# EAGLE design multi-level_converter (EAGLE 6.6.0)
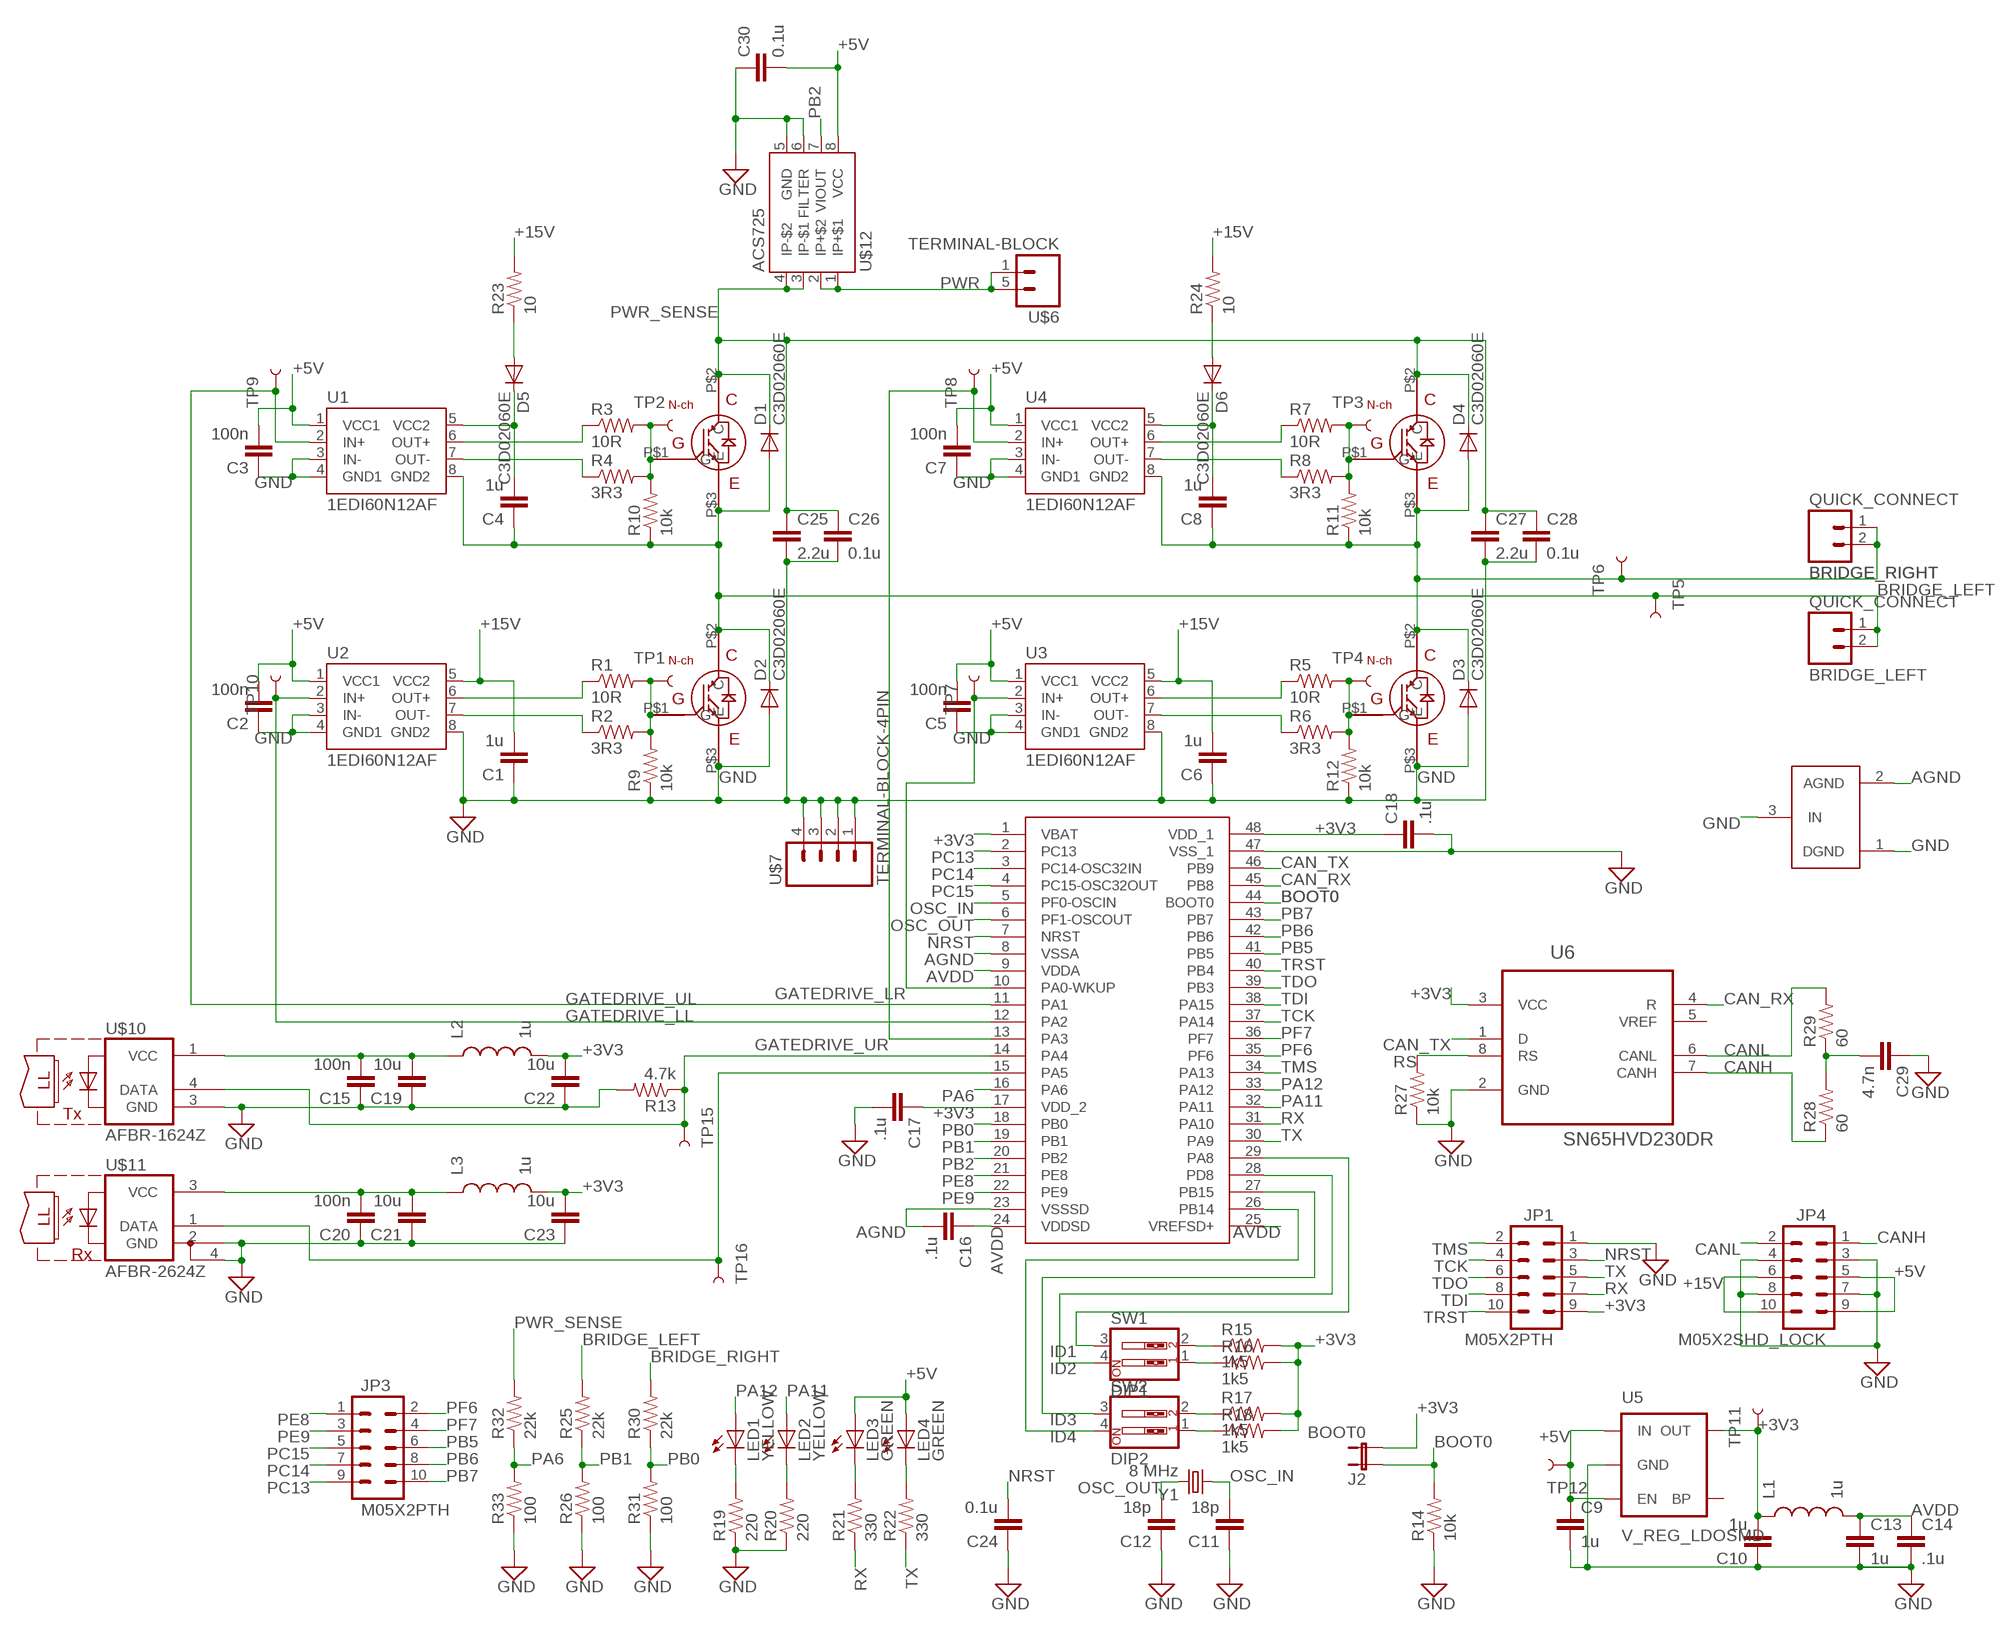
[diagram p0: schematic, sheet 1]

## Parts
BRIDGE_LEFT  QUICK_CONNECT  [QUICK_CONNECT]
BRIDGE_RIGHT  QUICK_CONNECT  [QUICK_CONNECT]
C1  1u  CAP0805  [0805]
C2  100n  CAP0805  [0805]
C3  100n  CAP0805  [0805]
C4  1u  CAP0805  [0805]
C5  100n  CAP0805  [0805]
C6  1u  CAP0805  [0805]
C7  100n  CAP0805  [0805]
C8  1u  CAP0805  [0805]
C9  1u  CAP0805  [0805]
C10  1u  CAP0805  [0805]
C11  18p  CAP0805  [0805]
C12  18p  CAP0805  [0805]
C13  1u  CAP0805  [0805]
C14  .1u  CAP0805  [0805]
C15  100n  CAP0805  [0805]
C16  .1u  CAP0805  [0805]
C17  .1u  CAP0805  [0805]
C18  .1u  CAP0805  [0805]
C19  10u  CAP0805  [0805]
C20  100n  CAP0805  [0805]
C21  10u  CAP0805  [0805]
C22  10u  CAP0805  [0805]
C23  10u  CAP0805  [0805]
C24  0.1u  CAP0805  [0805]
C25  2.2u  C37/20  [C37.5B20]
C26  0.1u  C-EUC2225K  [C2225K]
C27  2.2u  C37/20  [C37.5B20]
C28  0.1u  C-EUC2225K  [C2225K]
C29  4.7n  CAP0805  [0805]
C30  0.1u  CAP0805  [0805]
D1  C3D02060E  [TO252]
D2  C3D02060E  [TO252]
D3  C3D02060E  [TO252]
D4  C3D02060E  [TO252]
D5  C3D02060E  [TO252]
D6  C3D02060E  [TO252]
J1  GND_CONNECT  [GND_CONNECT]
J2  BOOT0  JUMPER-2PTH  [1X02]
JP1  M05X2PTH  [AVR_ICSP]
JP3  M05X2PTH  [AVR_ICSP]
JP4  M05X2SHD_LOCK  [2X5-SHROUDED_LOCK]
L1  1u  INDUCTOR0805  [0805]
L2  1u  INDUCTOR0805  [0805]
L3  1u  INDUCTOR0805  [0805]
LED1  YELLOW  LED0603  [LED-0603]
LED2  YELLOW  LED0603  [LED-0603]
LED3  GREEN  LED0603  [LED-0603]
LED4  GREEN  LED0603  [LED-0603]
R1  10R  RESISTOR0805-RES  [0805]
R2  3R3  RESISTOR0805-RES  [0805]
R3  10R  RESISTOR0805-RES  [0805]
R4  3R3  RESISTOR0805-RES  [0805]
R5  10R  RESISTOR0805-RES  [0805]
R6  3R3  RESISTOR0805-RES  [0805]
R7  10R  RESISTOR0805-RES  [0805]
R8  3R3  RESISTOR0805-RES  [0805]
R9  10k  RESISTOR0805-RES  [0805]
R10  10k  RESISTOR0805-RES  [0805]
R11  10k  RESISTOR0805-RES  [0805]
R12  10k  RESISTOR0805-RES  [0805]
R13  4.7k  RESISTOR0805-RES  [0805]
R14  10k  RESISTOR0805-RES  [0805]
R15  1k5  RESISTOR0805-RES  [0805]
R16  1k5  RESISTOR0805-RES  [0805]
R17  1k5  RESISTOR0805-RES  [0805]
R18  1k5  RESISTOR0805-RES  [0805]
R19  220  RESISTOR0805-RES  [0805]
R20  220  RESISTOR0805-RES  [0805]
R21  330  RESISTOR0805-RES  [0805]
R22  330  RESISTOR0805-RES  [0805]
R23  10  RESISTOR0805-RES  [0805]
R24  10  RESISTOR0805-RES  [0805]
R25  22k  RESISTOR0805-RES  [0805]
R26  100  RESISTOR0805-RES  [0805]
R27  10k  RESISTOR0805-RES  [0805]
R28  60  RESISTOR0805-RES  [0805]
R29  60  RESISTOR0805-RES  [0805]
R30  22k  RESISTOR0805-RES  [0805]
R31  100  RESISTOR0805-RES  [0805]
R32  22k  RESISTOR0805-RES  [0805]
R33  100  RESISTOR0805-RES  [0805]
SW1  DIP1  SW_DIP-2  [DIPSWITCH-02]
SW2  DIP2  SW_DIP-2  [DIPSWITCH-02]
TP1  TEST-POINT3X5  [PAD.03X.05]
TP2  TEST-POINT3X5  [PAD.03X.05]
TP3  TEST-POINT3X5  [PAD.03X.05]
TP4  TEST-POINT3X5  [PAD.03X.05]
TP5  TEST-POINT3X5  [PAD.03X.05]
TP6  TEST-POINT3X5  [PAD.03X.05]
TP7  TEST-POINT3X5  [PAD.03X.05]
TP8  TEST-POINT3X5  [PAD.03X.05]
TP9  TEST-POINT3X5  [PAD.03X.05]
TP10  TEST-POINT3X5  [PAD.03X.05]
TP11  TEST-POINT3X5  [PAD.03X.05]
TP12  TEST-POINT3X5  [PAD.03X.05]
TP15  TEST-POINT3X5  [PAD.03X.05]
TP16  TEST-POINT3X5  [PAD.03X.05]
U1  1EDI60N12AF  [SO08]
U2  1EDI60N12AF  [SO08]
U3  1EDI60N12AF  [SO08]
U4  1EDI60N12AF  [SO08]
U5  V_REG_LDOSMD  [SOT23-5]
U6  SN65HVD230DR  [SOIC127P600X175-8N]
U$1  TO-247B  [TO-247-FLAT]
U$2  TO-247B  [TO-247-FLAT]
U$3  TO-247B  [TO-247-FLAT]
U$4  TO-247B  [TO-247-FLAT]
U$5  STM32F373CCT6  [LQFP48]
U$6  TERMINAL-BLOCK  [10MM_2PIN_CONNECTOR]
U$7  TERMINAL-BLOCK-4PIN  [10MM_4PIN_CONNECTOR]
U$10  AFBR-1624Z  [HFBR-15X3]
U$11  AFBR-2624Z  [HFBR-15X3]
U$12  ACS725  [SO08]
Y1  8 MHz  CRYSTALSMD  [HC49UP]

## Nets
+3V3: C10.2 C17.1 C18.1 C22.2 C23.2 J2.2 JP1.9 L1.1 L2.2 L3.2 R15.2 R16.2 R17.2 R18.2 TP11.P$1 U5.VS(OUT) U6.3(VCC) U$5.1(VBAT) U$5.17(VDD_2) U$5.48(VDD_1)
+5V: C2.2 C3.2 C5.2 C7.2 C9.1 C30.2 JP4.5 JP4.9 LED3.A LED4.A TP12.P$1 U1.1(VCC1) U2.1(VCC1) U3.1(VCC1) U4.1(VCC1) U5.CS(IN) U5.GATE(EN) U$12.8(VCC)
+15V: C1.2 C6.2 JP4.6 JP4.10 R23.2 R24.2 U2.5(VCC2) U3.5(VCC2)
AGND: C16.2 J1.2(AGND) U$5.8(VSSA) U$5.23(VSSSD)
AVDD: C13.1 C14.1 C16.1 L1.2 U$5.9(VDDA) U$5.24(VDDSD) U$5.25(VREFSD+)
BOOT0: J2.1 R14.2 U$5.44(BOOT0)
BRIDGE_LEFT: BRIDGE_LEFT.1 BRIDGE_LEFT.2 C4.1 D1.2(A) D2.1(C) D2.3(C) R10.1 R25.2 TP5.P$1 U1.8(GND2) U$1.P$3(E) U$3.P$2(C)
BRIDGE_RIGHT: BRIDGE_RIGHT.1 BRIDGE_RIGHT.2 C8.1 D3.1(C) D3.3(C) D4.2(A) R11.1 R30.2 TP6.P$1 U4.8(GND2) U$2.P$2(C) U$4.P$3(E)
CAN_RX: U6.4(R) U$5.45(PB8)
CAN_TX: U6.1(D) U$5.46(PB9)
CANH: JP4.1 R28.1 U6.7(CANH)
CANL: JP4.2 R29.2 U6.6(CANL)
G_LL: R1.2 R2.2 R9.2 TP1.P$1 U$3.P$1(G)
G_LR: R5.2 R6.2 R12.2 TP4.P$1 U$2.P$1(G)
G_UL: R3.2 R4.2 R10.2 TP2.P$1 U$1.P$1(G)
G_UR: R7.2 R8.2 R11.2 TP3.P$1 U$4.P$1(G)
GATEDRIVE_LL: TP10.P$1 U2.2(IN+) U$5.12(PA2)
GATEDRIVE_LR: TP7.P$1 U3.2(IN+) U$5.10(PA0-WKUP)
GATEDRIVE_UL: TP9.P$1 U1.2(IN+) U$5.11(PA1)
GATEDRIVE_UR: TP8.P$1 U4.2(IN+) U$5.13(PA3)
GND: C1.1 C2.1 C3.1 C5.1 C6.1 C7.1 C9.2 C10.1 C11.1 C12.1 C13.2 C14.2 C15.1 C17.2 C18.2 C19.1 C20.1 C21.1 C22.1 C23.1 C24.1 C25.2 C26.2 C27.2 C28.2 C29.1 C30.1 D2.2(A) D3.2(A) J1.1(DGND) J1.3(IN) JP1.1 JP4.3 JP4.4 JP4.7 JP4.8 R9.1 R12.1 R13.2 R14.1 R19.1 R20.1 R26.1 R27.1 R31.1 R33.1 U1.3(IN-) U1.4(GND1) U2.3(IN-) U2.4(GND1) U2.8(GND2) U3.3(IN-) U3.4(GND1) U3.8(GND2) U4.3(IN-) U4.4(GND1) U5.N/C(GND) U6.2(GND) U$2.P$3(E) U$3.P$3(E) U$5.47(VSS_1) U$7.1 U$7.2 U$7.3 U$7.4 U$10.3(GND) U$11.2(GND) U$11.4(GND1) U$12.5(GND) U$12.6(FILTER)
ID1: SW1.3 U$5.29(PA8)
ID2: SW1.4 U$5.28(PD8)
ID3: SW2.3 U$5.27(PB15)
ID4: SW2.4 U$5.26(PB14)
N$1: C8.2 D6.1(C) D6.3(C) U4.5(VCC2)
N$4: R1.1 U2.6(OUT+)
N$5: R2.1 U2.7(OUT-)
N$6: R3.1 U1.6(OUT+)
N$7: R4.1 U1.7(OUT-)
N$9: R5.1 U3.6(OUT+)
N$10: R6.1 U3.7(OUT-)
N$12: R7.1 U4.6(OUT+)
N$13: R8.1 U4.7(OUT-)
N$21: LED3.C R21.2
N$22: LED4.C R22.2
N$23: R15.1 SW1.2
N$24: R16.1 SW1.1
N$25: R17.1 SW2.2
N$27: R18.1 SW2.1
N$29: C15.2 C19.2 L2.1 U$10.1(VCC)
N$30: C20.2 C21.2 L3.1 U$11.3(VCC)
N$32: R13.1 TP15.P$1 U$5.14(PA4) U$10.4(DATA)
N$33: TP16.P$1 U$5.15(PA5) U$11.1(DATA)
N$34: LED1.C R19.2
N$35: LED2.C R20.2
N$36: D5.2(A) R23.1
N$37: C4.2 D5.1(C) D5.3(C) U1.5(VCC2)
N$38: D6.2(A) R24.1
N$42: C29.2 R28.2 R29.1
NRST: C24.2 JP1.3 U$5.7(NRST)
OSC_IN: C11.2 U$5.5(PF0-OSCIN) Y1.1
OSC_OUT: C12.2 U$5.6(PF1-OSCOUT) Y1.2
PA6: R32.1 R33.2 U$5.16(PA6)
PA11: LED2.A U$5.32(PA11)
PA12: LED1.A U$5.33(PA12)
PB0: R30.1 R31.2 U$5.18(PB0)
PB1: R25.1 R26.2 U$5.19(PB1)
PB2: U$5.20(PB2) U$12.7(VIOUT)
PB5: JP3.6 U$5.41(PB5)
PB6: JP3.8 U$5.42(PB6)
PB7: JP3.10 U$5.43(PB7)
PC13: JP3.9 U$5.2(PC13)
PC14: JP3.7 U$5.3(PC14-OSC32IN)
PC15: JP3.5 U$5.4(PC15-OSC32OUT)
PE8: JP3.1 U$5.21(PE8)
PE9: JP3.3 U$5.22(PE9)
PF6: JP3.2 U$5.35(PF6)
PF7: JP3.4 U$5.36(PF7)
PWR: U$6.1 U$6.5 U$12.1(IP+$1) U$12.2(IP+$2)
PWR_SENSE: C25.1 C26.1 C27.1 C28.1 D1.1(C) D1.3(C) D4.1(C) D4.3(C) R32.2 U$1.P$2(C) U$4.P$2(C) U$12.3(IP-$1) U$12.4(IP-$2)
RS: R27.2 U6.8(RS)
RX: JP1.7 R21.1 U$5.31(PA10)
TCK: JP1.4 U$5.37(PA14)
TDI: JP1.8 U$5.38(PA15)
TDO: JP1.6 U$5.39(PB3)
TMS: JP1.2 U$5.34(PA13)
TRST: JP1.10 U$5.40(PB4)
TX: JP1.5 R22.1 U$5.30(PA9)
Unconnected: U5.COM(BP) U6.5(VREF)

## Library data of the parts
BRIDGE_LEFT BRIDGE_RIGHT = DragonflyLBR2:QUICK_CONNECT
C1-C24 C29 C30 = DragonflyLBR2:CAP: Capacitor Standard 0603 ceramic capacitor, and 0.1" leaded capacitor.
C25 C27 = capacitor-wima:C: CAPACITOR naming: grid - package width
C26 C28 = resistor:C-EU: CAPACITOR, European symbol
D1-D6 = DragonflyLBR2:C3D02060E
J1 = DragonflyLBR2:GND_CONNECT
J2 = DragonflyLBR2:JUMPER-2: Jumper Basic 0.1" spaced jumper. Use with breakaway headers.
JP1 JP3 JP4 = DragonflyLBR2:M05X2: Header 5x2 Standard 10-pin dual row 0.1" header. Commonly used with AVR-ISP. Use with Spark Fun Electronics SKU: PRT-00778
L1-L3 = DragonflyLBR2:INDUCTOR: Inductors Basic Inductor/Choke - 0603 and 1206. Footprints are not proven and vary greatly between part numbers.
LED1-LED4 = DragonflyLBR2:LED: LEDs Standard schematic elements and footprints for 5mm, 3mm, 1206, and 0603 sized LEDs. 5mm - Spark Fun Electronics SKU : COM-00529 (and others)
R1-R33 = DragonflyLBR2:RESISTOR: Resistor Basic schematic elements and footprints for 0603, 1206, and PTH resistors.
SW1 SW2 = DragonflyLBR2:SW_DIP-2: DIP SWITCH
TP1-TP12 TP15 TP16 = DragonflyLBR2:TEST-POINT
U1-U4 = DragonflyLBR2:1EDI60N12AF
U5 = DragonflyLBR2:V_REG_LDO: Voltage Regulator LDO Standard 150mA LDO voltage regulator in SOT-23 layout. Micrel part MIC5205. BP (by-pass) pin is used to lower output noise with 470pF cap.
U6 = Texas Instruments_By_element14_Batch_1:SN65HVD230DR: 3.3-V CAN TRANSCEIVERS; MPN: SN65HVD230DR; OC_FARNELL: 8452148; OC_NEWARK: 75C7745; PACKAGE: SOIC-8; SUPPLIER: Texas Instruments
U$1-U$4 = DragonflyLBR2:TO-247
U$5 = carrilib:STM32F373CCT6
U$6 = DragonflyLBR2:TERMINAL-BLOCK
U$7 = DragonflyLBR2:TERMINAL-BLOCK-4PIN
U$10 = fiber-optic-hp:AFBR-1624Z
U$11 = fiber-optic-hp:AFBR-2624Z
U$12 = DragonflyLBR2:ACS725
Y1 = DragonflyLBR2:CRYSTAL: Crystals Various standard crystals. Proven footprints. Spark Fun Electronics SKU : COM-00534

## Board
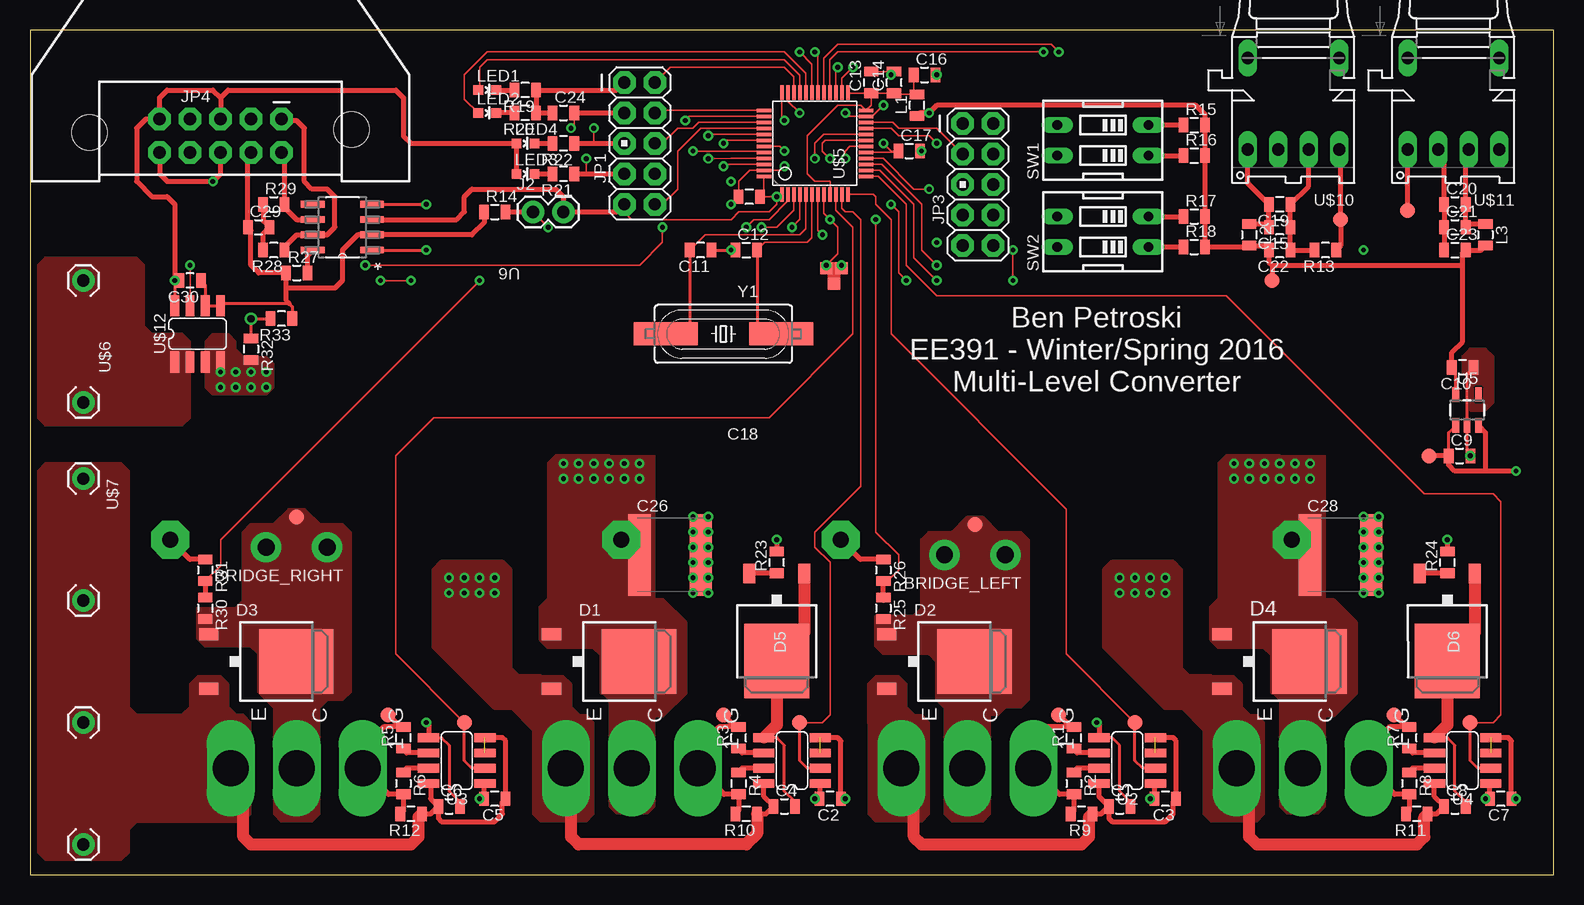
[diagram p1: board, top side]
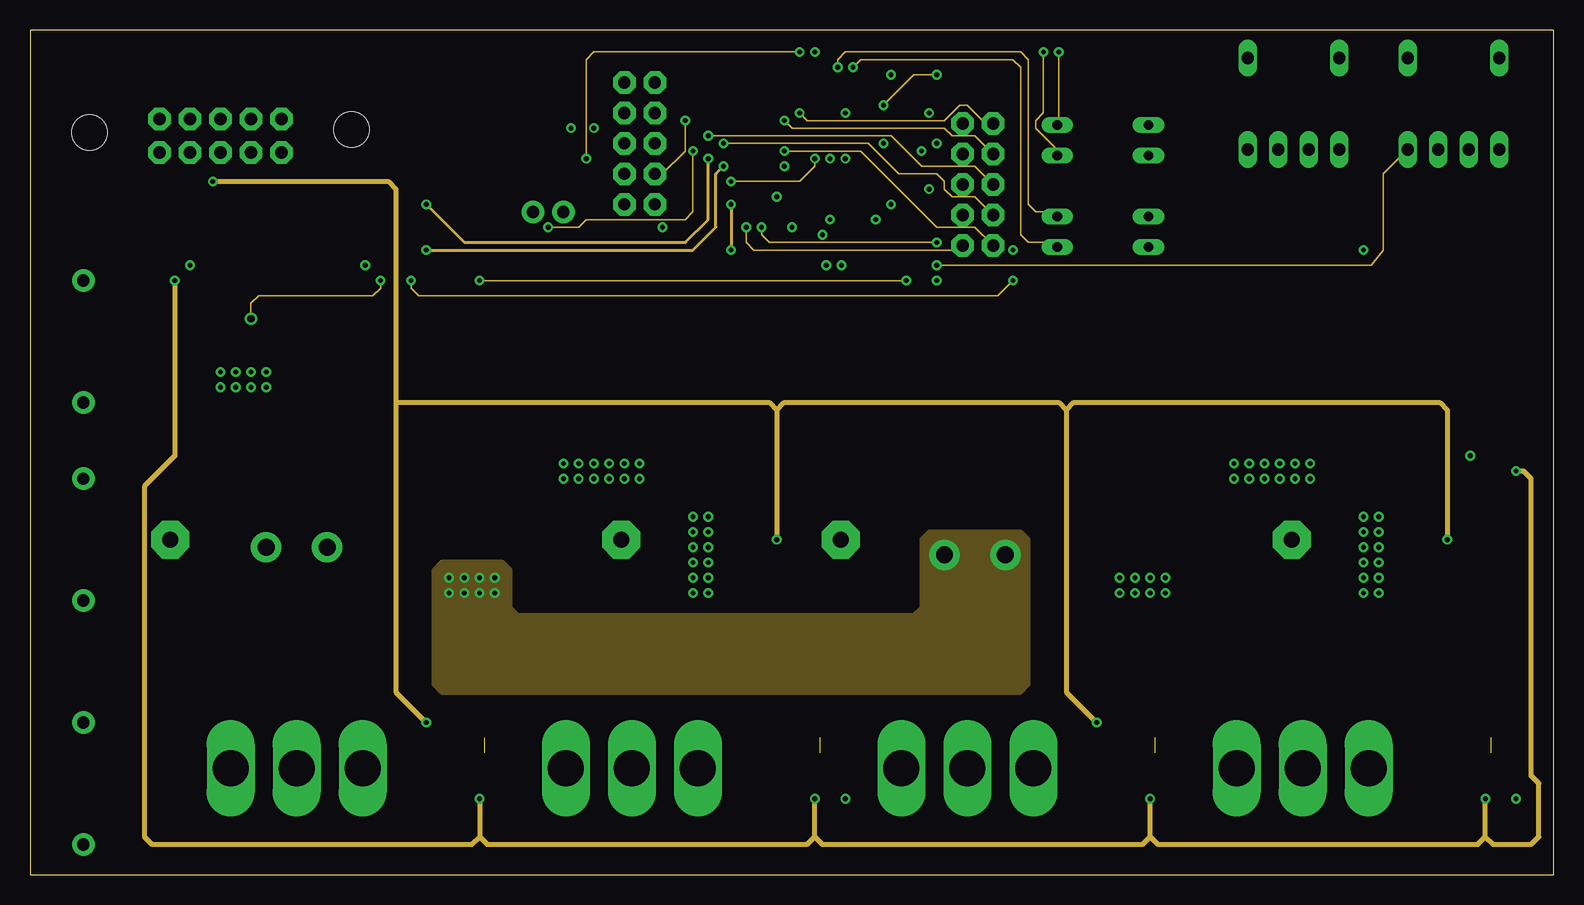
[diagram p2: board, inner layer Route2]
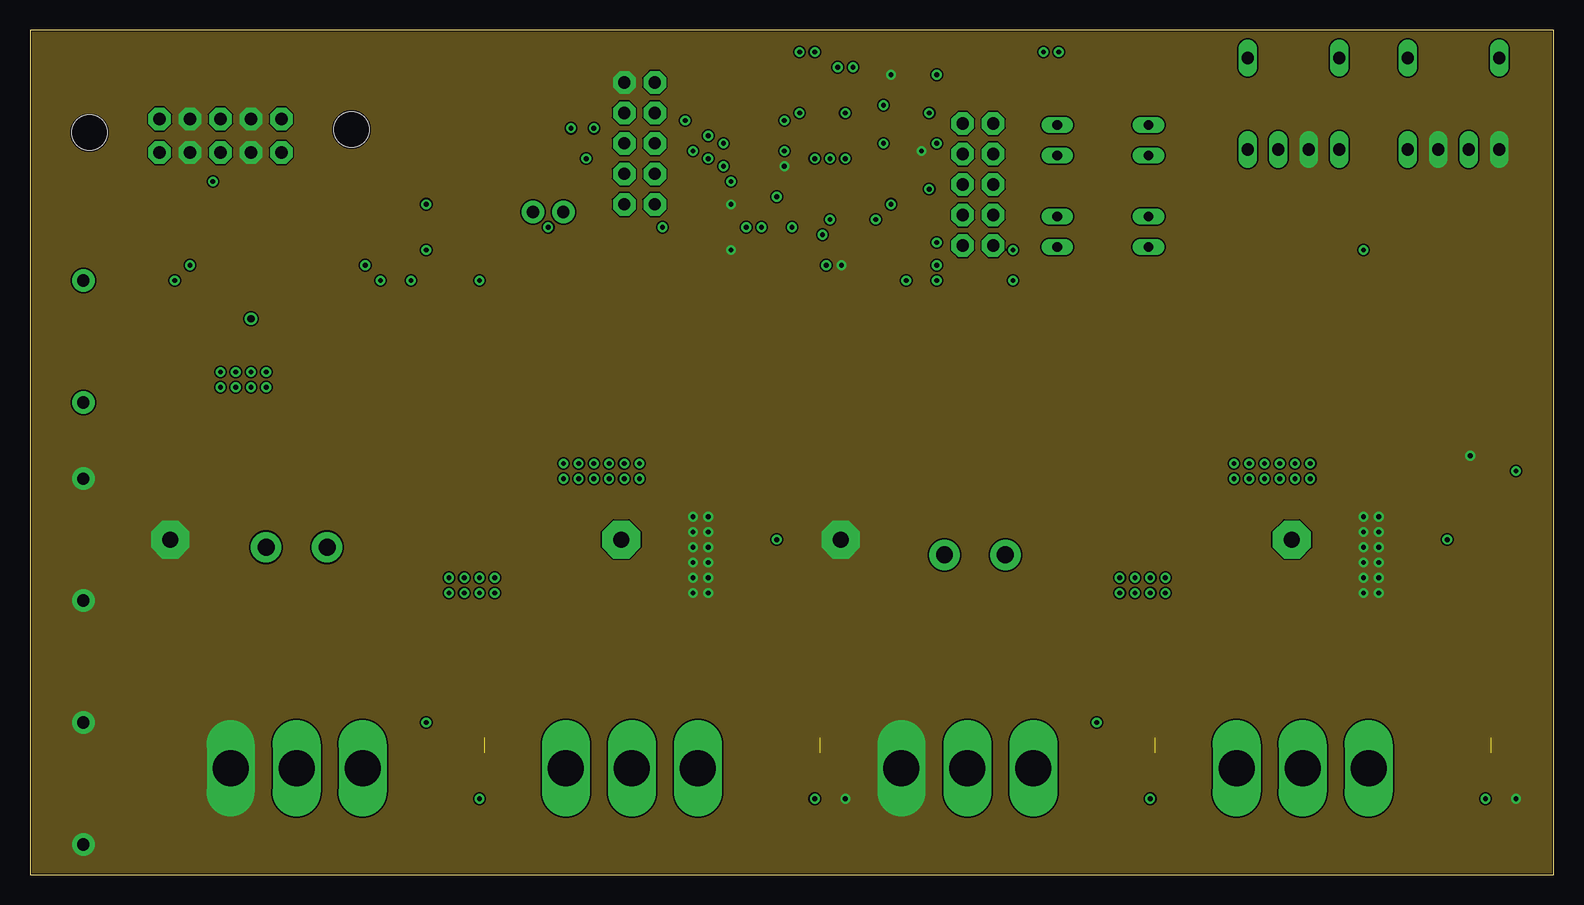
[diagram p3: board, inner layer Route15]
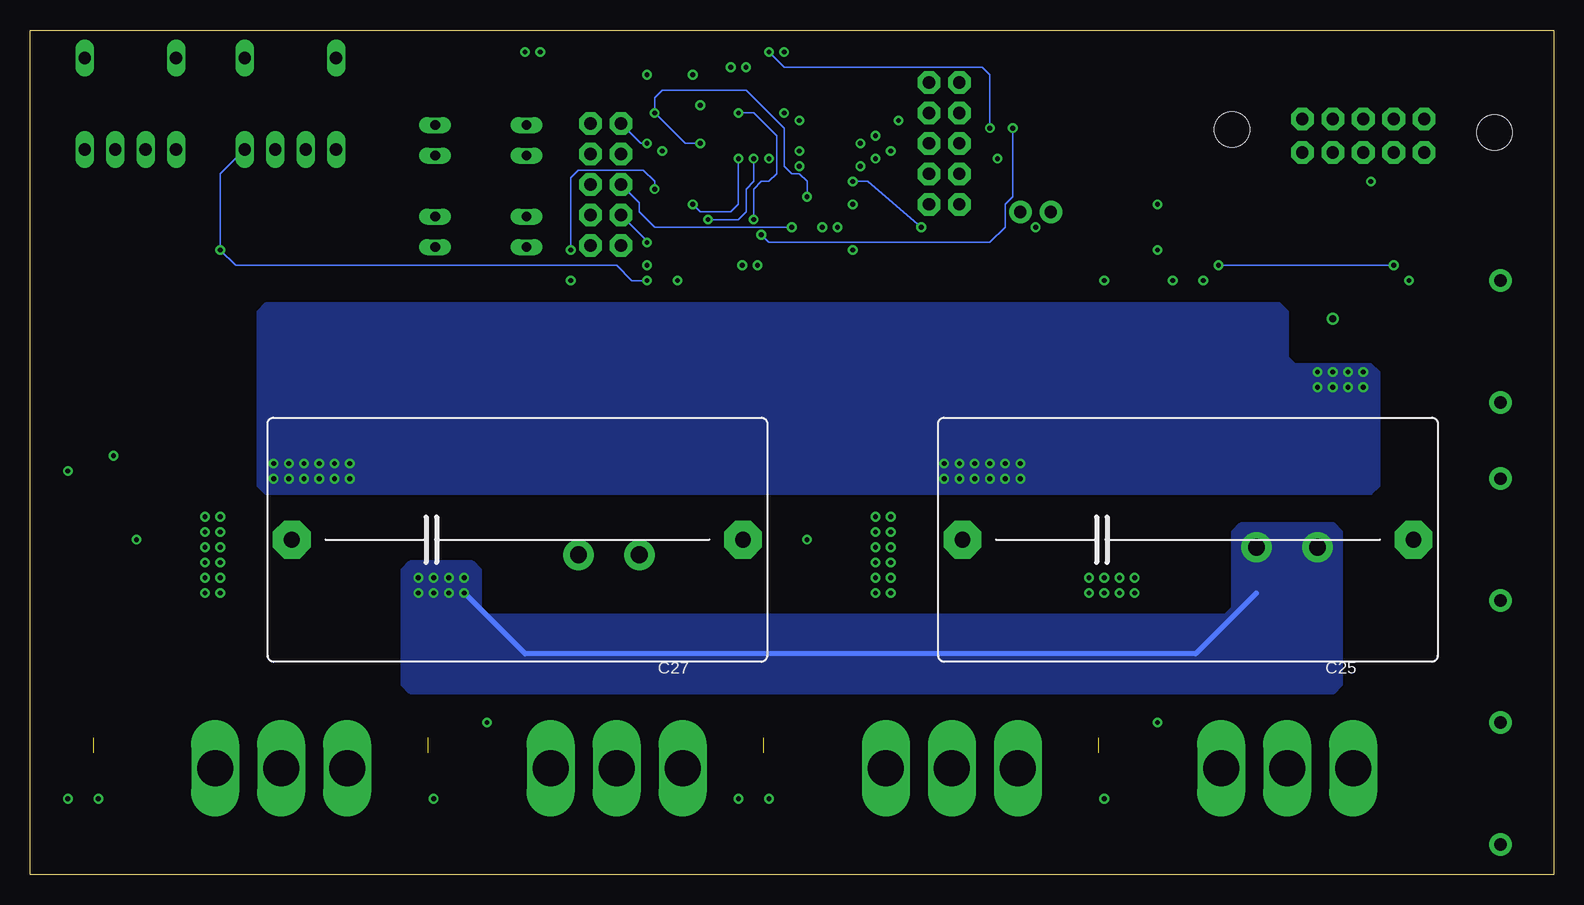
[diagram p4: board, bottom side, seen from below]

Size 126.98 x 70.41 mm. Coordinates in mm from the lower left corner, seen from the top.
Outline: 0,0 126.98,0 126.98,70.41 0,70.41 0,0
Copper layers (1*2*15*16): Top 0.035mm / dielectric 0.5mm / Route2 0.035mm / dielectric 0.5mm / Route15 0.035mm / dielectric 0.5mm / Bottom 0.035mm
Design rules "default *": minimum track width 5mil, minimum drill 10mil, track to track 5mil, track to pad 5mil, pad to pad 5mil, via to via 5mil, smd to smd 5mil, copper to edge 5mil, drill to drill 5mil, minimum pad ring 10mil, minimum via ring 8mil, stop-mask expansion 4mil, vias tented up to drill 0mil, thermal gap 10mil

### Footprints (pad centres in the part's own frame; a part is rotated, then mirrored left to right if it is on the bottom)
QUICK_CONNECT = drill 1.4 pad 2.54: 1 5.08,0; 2 0,0
0805 = smd 0.8 x 1.2: 1 -0.9,0; 2 0.9,0
C37.5B20 = drill 1.321 pad 3.15 octagon: 1 -18.796,0; 2 18.796,0
C2225K = smd 1.85 x 6.8: 1 -2.55,0; 2 2.55,0
TO252 = smd 1 x 1.6: 1 -2.28,-4.8; 2 2.28,-4.8 | smd 5.4 x 6.2: 3 0,2.5
GND_CONNECT = smd 1.016 x 1.016: 1 -1.016,0; 2 -1.016,-1.27; 3 0.254,-0.635
1X02 = drill 1.016 pad 1.88: 1 0,0; 2 2.54,0
AVR_ICSP = drill 1.016 pad 1.88 octagon: 1 -1.27,5.08; 2 1.27,5.08; 3 -1.27,2.54; 4 1.27,2.54; 5 -1.27,0; 6 1.27,0; 7 -1.27,-2.54; 8 1.27,-2.54; 9 -1.27,-5.08; 10 1.27,-5.08
2X5-SHROUDED_LOCK = drill 1.016 pad 1.88 octagon: 1 -1.397,5.08; 2 1.397,5.08; 3 -1.397,2.54; 4 1.397,2.54; 5 -1.397,0; 6 1.397,0; 7 -1.397,-2.54; 8 1.397,-2.54; 9 -1.397,-5.08; 10 1.397,-5.08 | hole 2.946: -0.254,-10.922; -0.508,10.922
LED-0603 = smd 0.8 x 0.8: A 0,-0.75; C 0,0.75
DIPSWITCH-02 = drill 0.813 long: 1 -1.27,-3.81; 2 1.27,-3.81; 3 1.27,3.81; 4 -1.27,3.81
PAD.03X.05 = smd 1.27 x 1.27: P$1 0,0
SO08 = smd 0.72 x 1.78: 1 -1.905,-2.35; 2 -0.635,-2.35; 3 0.635,-2.35; 4 1.905,-2.35; 5 1.905,2.35; 6 0.635,2.35; 7 -0.635,2.35; 8 -1.905,2.35
SOT23-5 = smd 0.55 x 1.2: COM 0.95,1.3; CS -0.95,-1.3; GATE 0.95,-1.3; N/C 0,-1.3; VS -0.95,1.3
SOIC127P600X175-8N = smd 1.981 x 0.559: 1 -2.464,1.905; 2 -2.464,0.635; 3 -2.464,-0.635; 4 -2.464,-1.905; 5 2.464,-1.905; 6 2.464,-0.635; 7 2.464,0.635; 8 2.464,1.905
TO-247-FLAT = drill 3 pad 3.81 long: P$1 0,5.5; P$2 0,0; P$3 0,-5.5
LQFP48 = smd 1.2 x 0.3: 1 -4.25,2.75; 2 -4.25,2.25; 3 -4.25,1.75; 4 -4.25,1.25; 5 -4.25,0.75; 6 -4.25,0.25; 7 -4.25,-0.25; 8 -4.25,-0.75; 9 -4.25,-1.25; 10 -4.25,-1.75; 11 -4.25,-2.25; 12 -4.25,-2.75; 25 4.25,-2.75; 26 4.25,-2.25; 27 4.25,-1.75; 28 4.25,-1.25; 29 4.25,-0.75; 30 4.25,-0.25; 31 4.25,0.25; 32 4.25,0.75; 33 4.25,1.25; 34 4.25,1.75; 35 4.25,2.25; 36 4.25,2.75 | smd 0.3 x 1.2: 13 -2.75,-4.25; 14 -2.25,-4.25; 15 -1.75,-4.25; 16 -1.25,-4.25; 17 -0.75,-4.25; 18 -0.25,-4.25; 19 0.25,-4.25; 20 0.75,-4.25; 21 1.25,-4.25; 22 1.75,-4.25; 23 2.25,-4.25; 24 2.75,-4.25; 37 2.75,4.25; 38 2.25,4.25; 39 1.75,4.25; 40 1.25,4.25; 41 0.75,4.25; 42 0.25,4.25; 43 -0.25,4.25; 44 -0.75,4.25; 45 -1.25,4.25; 46 -1.75,4.25; 47 -2.25,4.25; 48 -2.75,4.25
10MM_2PIN_CONNECTOR = drill 1.016 pad 1.88: 1 -5.08,0; 5 5.08,0
10MM_4PIN_CONNECTOR = drill 1.016 pad 1.88: 1 0,0; 2 10.16,0; 3 20.32,0; 4 30.48,0
HFBR-15X3 = drill 1.016 long: 1 3.81,9.525; 2 1.27,9.525; 3 -1.27,9.525; 4 -3.81,9.525; 5 -3.81,1.905; 8 3.81,1.905
HC49UP = smd 5.334 x 1.93: 1 -4.826,0; 2 4.826,0

### Placement (x,y rotation side)
BRIDGE_LEFT  81.28,26.67 180 top
BRIDGE_RIGHT  24.77,27.3 180 top
C1  90.81,5.71 0 top
C2  66.67,6.35 180 top
C3  94.61,6.35 180 top
C4  62.87,5.71 0 top
C5  38.73,6.35 180 top
C6  34.92,5.71 0 top
C7  122.56,6.35 180 top
C8  118.75,5.71 0 top
C9  119.13,34.92 0 top
C10  119.38,42.29 180 top
C11  55.88,52.07 180 top
C12  59.69,52.07 0 top
C13  70.1,66.04 90 top
C14  72.01,66.04 90 top
C15  104.14,53.98 180 top
C16  74.55,66.67 0 top
C17  73.28,60.33 0 top
C18  59.94,56.52 180 top
C19  104.14,55.88 180 top
C20  118.75,55.88 0 top
C21  118.75,53.98 0 top
C22  104.14,52.07 180 top
C23  118.75,52.07 0 top
C24  44.45,63.5 0 top
C25  30.48,27.94 0 bottom
C26  53.34,26.67 0 top
C27  86.36,27.94 0 bottom
C28  109.22,26.67 0 top
C29  19.05,53.98 0 top
C30  13.34,49.53 180 top
D1  48.26,17.78 270 top
D2  76.2,17.78 270 top
D3  19.68,17.78 270 top
D4  104.14,17.78 270 top
D5  62.23,20.32 180 top
D6  118.11,20.32 180 top
J1  67.63,49.53 270 top
J2  41.91,55.24 0 top
JP1  50.8,60.96 0 top
JP3  78.99,57.53 0 top
JP4  15.88,61.59 270 top
L1  73.91,64.14 90 top
L2  101.6,53.34 270 top
L3  121.28,53.34 270 top
LED1  38.1,65.41 270 top
LED2  38.1,63.5 270 top
LED3  41.27,58.42 270 top
LED4  41.27,60.96 270 top
R1  87,11.43 90 top
R2  87,7.62 270 top
R3  59.05,11.43 90 top
R4  59.05,7.62 270 top
R5  31.11,11.43 90 top
R6  31.11,7.62 270 top
R7  114.94,11.43 90 top
R8  114.94,7.62 270 top
R9  87.63,5.08 180 top
R10  59.69,5.08 180 top
R11  115.57,5.08 180 top
R12  31.75,5.08 180 top
R13  107.95,52.07 180 top
R14  38.73,55.24 0 top
R15  97.03,62.48 0 top
R16  97.03,59.94 0 top
R17  97.03,54.86 0 top
R18  97.03,52.32 0 top
R19  41.27,65.41 180 top
R20  41.27,63.5 180 top
R21  44.45,58.42 180 top
R22  44.45,60.96 180 top
R23  62.23,26.04 90 top
R24  118.11,26.04 90 top
R25  71.12,22.23 270 top
R26  71.12,25.4 270 top
R27  22.23,50.16 0 top
R28  20.32,52.07 180 top
R29  20.32,55.88 0 top
R30  14.61,22.23 270 top
R31  14.61,25.4 270 top
R32  18.41,43.81 270 top
R33  20.95,46.35 180 top
SW1  89.41,61.21 90 top
SW2  89.41,53.59 90 top
TP1  85.72,13.34 0 top
TP2  57.78,13.34 0 top
TP3  113.67,13.34 270 top
TP4  29.84,13.34 0 top
TP5  78.74,29.21 0 top
TP6  22.23,29.84 0 top
TP7  36.2,12.7 270 top
TP8  120.02,12.7 270 top
TP9  64.14,12.7 270 top
TP10  92.08,12.7 270 top
TP11  103.5,49.53 90 top
TP12  116.59,34.92 180 top
TP15  109.22,54.61 90 top
TP16  114.81,55.37 90 top
U1  63.5,9.53 90 top
U2  91.44,9.53 90 top
U3  35.56,9.53 90 top
U4  119.38,9.53 90 top
U5  119.76,38.73 0 top
U6  26.04,53.98 180 top
U$1  50.16,8.89 270 top
U$2  22.23,8.89 270 top
U$3  78.11,8.89 270 top
U$4  106.05,8.89 270 top
U$5  65.41,60.96 90 top
U$6  4.45,44.45 270 top
U$7  4.45,33.02 270 top
U$10  105.28,69.98 180 top
U$11  118.62,69.98 180 top
U$12  13.97,45.09 0 top
Y1  57.78,45.09 0 top

### Tracks (layer width: path | path; a pad name or v marks a point on that pad's centre or on a via)
+3V3  (via drill 0.4 pad 0.03, 0.4 pad 0.25)
  Top 0.127: JP1.9 49.53,55.24 50.16,54.61 58.42,54.61 59.05,55.24 61.59,55.24 62.23,55.88 62.23,56.28 | 62.23,56.28 U$5.1 | 62.23,56.28 v62.23,56.52 61.16,56.52 | C18.1 61.16,56.52 | 61.16,56.52 U$5.48 | U$5.17 72.26,60.21 C17.1 71.75,60.33 v71.12,60.96
  Top 0.254: U5.VS 118.81,41.96 C10.2
  Top 0.406: C10.2 118.48,43.55 119.38,44.45 119.38,50.8 | 119.38,50.8 119.38,51.8 C23.2 120.92,52.07 L3.2 | 103.5,50.8 103.24,51.06 C22.2 102.87,52.44 L2.2 101.48,52.32 R18.2 R17.2 R16.2 R15.2 97.93,63.36 97.16,64.14 75.56,64.14 v74.93,63.5 74.18,63.5 L1.1 | 103.5,50.8 119.38,50.8 | U6.3 35.56,54.61 36.2,55.24 36.2,56.52 36.83,57.15 43.81,57.15 44.45,56.52 J2.2 48.9,55.24 JP1.9 | 103.5,50.8 TP11.P$1
  Bottom 0.127: v62.23,56.52 62.23,57.78 62.87,58.42 63.5,58.42 64.14,59.05 64.14,62.23 67.31,65.41 74.3,65.41 74.93,64.77 v74.93,63.5 72.39,60.96 v71.12,60.96
+5V  (via drill 0.4 pad 0.03)
  Top 0.254: C30.2 12.06,49.16 U$12.8 | C9.1 118.23,36.85 U5.CS
  Top 0.406: U3.1 37.84,7.54 C5.2 v37.47,6.35 | U1.1 65.85,6.42 C2.2 v65.41,6.35 | U2.1 93.72,7.54 C3.2 v93.34,6.35 | U4.1 121.66,7.54 C7.2 v121.28,6.35 | TP12.P$1 C9.1 118.23,34.17 118.75,33.66 121.28,33.66 | 15.88,64.77 15.24,65.41 11.43,65.41 10.79,64.77 JP4.9 9.65,62.99 8.89,62.23 8.89,57.78 10.16,56.52 11.43,56.52 12.06,55.88 12.06,49.9 C30.2 v12.06,49.53 | 15.88,64.77 JP4.5 | 15.88,64.77 16.51,65.41 30.48,65.41 31.11,64.77 31.11,61.59 31.75,60.96 LED4.A LED3.A | v123.83,33.66 121.28,33.66 | U5.GATE 121.28,36.86 121.28,33.66
  Route2 0.406: v37.47,6.35 37.47,3.17 | 37.47,3.17 38.1,2.54 64.77,2.54 65.41,3.17 | 65.41,3.17 v65.41,6.35 | 65.41,3.17 66.04,2.54 92.71,2.54 93.34,3.17 | 93.34,3.17 93.98,2.54 120.65,2.54 121.28,3.17 | 121.28,3.17 v121.28,6.35 | 93.34,3.17 v93.34,6.35 | 121.28,3.17 121.92,2.54 125.09,2.54 125.73,3.17 125.73,7.62 125.09,8.26 125.09,33.02 124.46,33.66 v123.83,33.66 | v12.06,49.53 12.06,34.92 9.53,32.38 9.53,3.17 10.16,2.54 36.83,2.54 37.47,3.17
+15V  (via drill 0.4 pad 0.03)
  Top 0.254: U3.5 34.29,11.43 34.92,10.79 34.92,6.99 35.56,6.35 35.56,5.98 C6.2 | C1.2 91.7,6.08 90.81,6.99 90.81,10.79 90.17,11.43 U2.5
  Top 0.406: JP4.10 10.79,58.42 11.43,57.78 v15.24,57.78 15.88,58.42 JP4.6 | v62.23,27.94 R23.2 | v118.11,27.94 R24.2 | v88.9,12.7 89.09,12.51 U2.5 | v33.02,12.7 33.21,12.51 U3.5
  Route2 0.406: v15.24,57.78 29.84,57.78 30.48,57.15 30.48,39.37 | 30.48,39.37 61.59,39.37 62.23,38.73 | 62.23,38.73 v62.23,27.94 | 62.23,38.73 62.87,39.37 85.72,39.37 86.36,38.73 | 86.36,38.73 86.36,15.24 v88.9,12.7 | 30.48,39.37 30.48,15.24 v33.02,12.7 | 86.36,38.73 87,39.37 117.47,39.37 118.11,38.73 v118.11,27.94
AGND  (via drill 0.4 pad 0.03)
  Top 0.127: C16.2 v75.56,66.67 | v71.12,64.14 70.19,63.21 U$5.23 68.29,63.21 68,63.5 v67.94,63.5 | U$5.8 66.16,55.13 v66.67,54.61 67.31,53.98 67.31,51.75 v66.36,50.8
  Top 0.406: v66.36,50.8 J1.2
  Route2 0.127: v75.56,66.67 73.66,66.67 v71.12,64.14
  Bottom 0.127: v67.94,63.5 66.67,63.5 64.77,61.59 64.77,58.42 65.41,57.78 66.04,57.78 66.67,57.15 v66.67,54.61
AVDD
  Top 0.127: C16.1 73.65,65.3 L1.2 72.11,65.03 C14.1 C13.1 | C13.1 68.22,65.14 U$5.25 | C13.1 70.1,64.16 U$5.24 69.23,64.14 67.31,64.14 64.77,61.59 64.77,58.42 65.41,57.78 66.67,57.78 66.67,56.73 U$5.9
BOOT0  (via drill 0.4 pad 0.03)
  Top 0.127: J2.1 v43.18,53.98 | v55.24,60.33 61.04,60.33 U$5.44
  Top 0.406: R14.2 J2.1
  Route2 0.127: v43.18,53.98 45.72,53.98 46.35,54.61 54.61,54.61 55.24,55.24 v55.24,60.33
BRIDGE_LEFT  (via drill 0.4 pad 0.25)
  Top 0.406: R10.1 61.33,5.08 C4.1 61.15,6.53 U1.8
  Top 1.016: R10.1 60.59,3.44 59.69,2.54 45.72,2.54 45.09,3.17 45.09,8.47 U$1.P$3
  other vias: 38.73,24.77 37.47,24.77 36.2,24.77 36.2,23.5 34.92,23.5 34.92,24.77 37.47,23.5 38.73,23.5
  pour Top (no thermals): 46.35,13.34 42.55,13.34 41.91,12.7 41.91,5.08 42.55,4.45 46.35,4.45 46.99,5.08 46.99,12.7
  pour Top (no thermals): 76.83,13.34 75.56,14.61 75.56,17.78 74.93,18.41 71.12,18.41 70.48,19.05 70.48,21.59 73.66,21.59 74.3,22.23 74.3,27.94 74.93,28.57 76.83,28.57 78.11,29.84 79.38,29.84 80.64,28.57 82.55,28.57 83.19,27.94 83.19,14.61 82.55,13.97 81.28,13.97 80.64,13.34
  pour Top (no thermals): 76.83,4.45 79.38,4.45 80.01,5.08 80.01,14.61 75.56,14.61 76.2,13.97 76.2,5.08
  pour Top (no thermals): 45.72,13.34 45.09,13.97 45.09,15.88 44.45,16.51 42.55,16.51 41.91,15.88 41.91,12.7
  pour Top (no thermals): 42.55,16.51 40.64,16.51 40.01,17.14 40.01,25.4 39.37,26.04 34.29,26.04 33.66,25.4 33.66,19.05 38.73,13.97 42.55,13.97
  pour Route2 (no thermals): 40.01,22.23 40.01,25.4 39.37,26.04 34.29,26.04 33.66,25.4 33.66,15.88 34.29,15.24 82.55,15.24 83.19,15.88 83.19,27.94 82.55,28.57 74.93,28.57 74.3,27.94 74.3,22.23 73.66,21.59 40.64,21.59
  pour Top (no thermals): 41.91,12.06 40.01,13.97 41.91,13.97
BRIDGE_RIGHT  (via drill 0.4 pad 0.25)
  Top 0.406: R11.1 117.21,5.08 C8.1 117.03,6.53 U4.8
  Top 1.016: R11.1 116.2,4.82 116.2,3.17 115.57,2.54 102.23,2.54 101.6,3.17 101.6,7.83 U$4.P$3
  Bottom 0.406: 24.77,23.5 29.84,18.41 85.72,18.41 v90.81,23.5
  other vias: 94.61,24.77 94.61,23.5 93.34,23.5 93.34,24.77 92.08,24.77 92.08,23.5 90.81,24.77
  pour Top (no thermals): 102.23,13.34 98.42,13.34 97.79,12.7 97.79,5.08 98.42,4.45 102.23,4.45 102.87,5.08 102.87,12.7
  pour Top (no thermals): 20.32,13.97 19.05,15.24 19.05,18.41 18.41,19.05 14.61,19.05 13.97,19.68 13.97,22.23 17.14,22.23 17.78,22.86 17.78,28.57 18.41,29.21 20.32,29.21 21.59,30.48 22.86,30.48 24.13,29.21 26.04,29.21 26.67,28.57 26.67,15.24 26.04,14.61 24.77,14.61 24.13,13.97
  pour Top (no thermals): 20.95,4.45 23.5,4.45 24.13,5.08 24.13,14.61 19.68,14.61 20.32,13.97 20.32,5.08
  pour Top (no thermals): 101.6,13.34 100.97,13.97 100.97,15.88 100.33,16.51 98.42,16.51 97.79,15.88 97.79,12.7
  pour Top (no thermals): 98.42,16.51 96.52,16.51 95.89,17.14 95.89,25.4 95.25,26.04 90.17,26.04 89.53,25.4 89.53,19.05 94.61,13.97 98.42,13.97
  pour Bottom (no thermals): 26.67,28.57 26.04,29.21 18.41,29.21 17.78,28.57 17.78,15.88 18.41,15.24 95.25,15.24 95.89,15.88 95.89,25.4 95.25,26.04 90.17,26.04 89.53,25.4 89.53,22.23 88.9,21.59 27.3,21.59 26.67,22.23
  pour Top (no thermals): 97.79,12.06 95.89,13.97 97.79,13.97
CAN_RX  (via drill 0.4 pad 0.03)
  Top 0.127: v56.52,59.69 58.44,59.71 U$5.45
  Top 0.254: U6.4 v33.02,55.88 | 61.13,59.69 U$5.45
  Route2 0.254: v33.02,55.88 36.2,52.7 54.61,52.7 56.52,54.61 v56.52,59.69
CAN_TX  (via drill 0.4 pad 0.03)
  Top 0.127: v57.78,59.05 57.94,59.21 U$5.46
  Top 0.254: U6.1 v33.02,52.07
  Route2 0.254: v33.02,52.07 55.24,52.07 57.15,53.98 57.15,58.42 v57.78,59.05
CANH
  Top 0.406: R28.1 21.22,52.34 22.23,53.34 U6.7 24.77,53.34 25.4,53.98 25.4,56.52 24.77,57.15 23.5,57.15 22.86,57.78 22.86,62.23 22.23,62.87 21.08,62.87 JP4.1
CANL
  Top 0.406: U6.6 22.23,54.61 21.22,55.62 R29.2 21.22,59.93 JP4.2
G_LL
  Top 0.406: TP1.P$1 86.73,12.33 R1.2 84.72,12.33 83.82,11.43 83.82,9.11 U$3.P$1 85.78,6.72 R2.2 87,5.34 R9.2
G_LR
  Top 0.406: R5.2 30.85,12.33 | 30.85,12.33 TP4.P$1 | 30.85,12.33 29.48,12.33 27.94,10.79 27.94,9.11 U$2.P$1 29.89,6.72 R6.2 31.11,5.34 R12.2
G_UL
  Top 0.406: R3.2 58.79,12.33 | 58.79,12.33 TP2.P$1 | 58.79,12.33 57.41,12.33 55.88,10.79 55.88,9.11 U$1.P$1 57.84,6.72 R4.2 59.05,5.34 R10.2
G_UR
  Top 0.406: R7.2 114.67,12.33 | 114.67,12.33 TP3.P$1 | 114.67,12.33 113.3,12.33 111.76,10.79 111.76,9.11 U$4.P$1 113.72,6.72 R8.2 114.94,5.34 R11.2
  pour Top: 110.49,5.08 109.86,5.71 109.86,11.43
GATEDRIVE_LL
  Top 0.127: U$5.12 70.29,56.71 70.48,56.52 70.48,55.88 71.75,54.61 71.75,45.09 86.36,30.48 86.36,18.41 TP10.P$1
  Top 0.254: U2.2 92.71,8.89 92.08,9.53 TP10.P$1
GATEDRIVE_LR
  Top 0.127: U$5.10 67.16,55.4 68.58,53.98 68.58,45.09 61.59,38.1 33.66,38.1 30.48,34.92 30.48,18.41 TP7.P$1
  Top 0.254: U3.2 36.83,8.89 36.2,9.53 TP7.P$1
GATEDRIVE_UL
  Top 0.127: U$5.11 67.66,55.53 67.94,55.24 68.58,55.24 69.22,54.61 69.22,32.38 65.41,28.57 65.41,27.3 66.67,26.04 66.67,13.34 66.04,12.7 TP9.P$1
  Top 0.254: U1.2 64.77,8.89 64.14,9.53 TP9.P$1
GATEDRIVE_UR
  Top 0.127: U$5.13 70.69,58.21 73.03,55.88 73.03,50.8 75.56,48.26 99.69,48.26 116.2,31.75 121.92,31.75 122.56,31.11 122.56,13.34 121.92,12.7 TP8.P$1
  Top 0.254: U4.2 120.65,8.89 120.02,9.53 TP8.P$1
GND  (via drill 0.4 pad 0.03, 0.4 pad 0.25)  (4 unrouted)
  Top 0.127: C17.2 74.3,60.44 v74.3,60.33 | C14.2 C13.2 69.85,66.94 | C18.2 59.05,56.53 59.05,57.78 59.98,58.71 U$5.47 62.52,58.71 v62.87,59.05
  Top 0.254: 33.39,7.62 U3.8 | 89.27,7.62 U2.8 | C30.1 14.61,49.16 U$12.6 U$12.5 16.07,47.62 21.59,47.62 21.86,47.36 R33.1 | C11.1 v58.42,52.07 | v58.42,52.07 C12.1 | C9.2 119.76,35.19 | 119.76,35.19 U5.N/C 119.76,41.77 C10.1 | v67.63,50.8 J1.1 | C18.2 59.05,56.52 v58.42,55.88 | v58.42,52.07 59.05,52.07 | v120.02,34.92 119.76,35.18 119.76,35.19
  Top 0.406: R12.1 33.39,5.08 C6.1 | 33.39,7.62 33.39,6.35 C6.1 | C6.1 34.02,4.71 34.29,4.45 38.73,4.45 39.37,5.08 39.37,6.08 C5.1 39.63,11.16 39.37,11.43 U3.4 | U1.4 67.31,11.43 67.58,11.16 C2.1 v67.94,6.35 | R9.1 89.27,5.08 C1.1 | C1.1 89.09,6.53 U2.8 | C1.1 89.91,4.71 90.17,4.45 94.61,4.45 95.25,5.08 95.25,6.08 C3.1 95.52,11.16 95.25,11.43 U2.4 | U4.4 123.19,11.43 123.45,11.16 C7.1 v123.83,6.35 | R31.1 13.32,26.3 C25.2 | R26.1 69.2,26.3 C27.2 | C23.1 C21.1 C20.1 117.84,59.95 U$11.2 | R13.2 C22.1 C15.1 C19.1 106.55,57.39 U$10.3 | JP4.4 18.15,59.93 C29.1 18.41,53.71 18.41,50.8 19.05,50.16 R27.1 21.32,48.9 | 21.32,48.9 21.32,47.89 21.59,47.62 | JP1.1 48.9,65.41 R19.1 R20.1 C24.1 | R14.1 37.84,54.34 36.83,53.34 U6.2 27.3,53.34 26.04,52.07 26.04,49.53 25.4,48.9 21.32,48.9 | v112.39,26.04 C28.2 | v71.75,66.67 C14.2 | v56.52,26.04 C26.2 | J1.3 66.99,49.91 J1.1
  Top 1.016: R12.1 32.38,4.82 32.38,3.17 31.75,2.54 18.41,2.54 17.78,3.17 17.78,7.83 U$2.P$3 | R9.1 88.27,4.82 88.27,3.17 87.63,2.54 74.3,2.54 73.66,3.17 73.66,7.83 U$3.P$3
  Route2 0.254: v58.42,55.88 v58.42,52.07
  other vias: 56.52,23.5 55.24,23.5 55.24,24.77 56.52,24.77 55.24,26.04 55.24,27.3 56.52,27.3 56.52,28.57 55.24,28.57 55.24,29.84 56.52,29.84 112.39,23.5 111.12,23.5 111.12,24.77 112.39,24.77 111.12,26.04 111.12,27.3 112.39,27.3 112.39,28.57 111.12,28.57 111.12,29.84 112.39,29.84
  pour Route15 (no thermals): -6.86,88.77 142.75,88.9 143.13,-10.92 -7.87,-11.56
  pour Top (no thermals): 7.62,34.29 1.27,34.29 0.64,33.66 0.64,1.91 1.27,1.27 7.62,1.27 8.26,1.91 8.26,33.66
  pour Top (no thermals): 8.26,3.81 8.89,4.45 17.78,4.45 18.41,5.08 18.41,12.7 17.78,13.34 8.89,13.34 8.26,13.97
  pour Top (no thermals): 74.3,13.34 70.48,13.34 69.85,12.7 69.85,5.08 70.48,4.45 74.3,4.45 74.93,5.08 74.93,12.7
  pour Top (no thermals): 120.02,38.73 121.28,38.73 121.92,39.37 121.92,43.18 121.28,43.81 120.02,43.81 119.38,43.18 119.38,41.91 120.02,41.27
  pour Top (no thermals): 17.14,13.34 16.51,13.97 16.51,15.88 15.88,16.51 13.97,16.51 13.34,15.88 13.34,13.97 12.7,13.34
  pour Top (no thermals): 73.66,13.34 73.03,13.97 73.03,15.88 72.39,16.51 70.48,16.51 69.85,15.88 69.85,12.7
ID1  (via drill 0.4 pad 0.03)
  Top 0.127: U$5.29 66.16,68.06 67.31,69.22 85.09,69.22 v85.72,68.58
  Route2 0.127: v85.72,68.58 85.72,62.61 SW1.3
ID2  (via drill 0.4 pad 0.03)
  Top 0.127: U$5.28 66.66,67.92 67.31,68.58 v84.45,68.58
  Route2 0.127: v84.45,68.58 84.45,63.5 83.82,62.87 83.82,62.23 85.72,60.33 85.72,60.07 SW1.4
ID3  (via drill 0.4 pad 0.03)
  Top 0.127: U$5.27 67.16,67.16 v67.31,67.31
  Route2 0.127: v67.31,67.31 67.31,67.94 67.94,68.58 82.55,68.58 83.19,67.94 83.19,55.88 83.82,55.24 85.22,55.24 SW2.3
ID4  (via drill 0.4 pad 0.03)
  Top 0.127: U$5.26 67.66,66.39 v68.58,67.31
  Route2 0.127: v68.58,67.31 69.22,67.94 81.92,67.94 82.55,67.31 82.55,53.34 83.19,52.7 85.22,52.7 SW2.4
N$1
  Top 0.254: C8.2 119.64,6.08 118.75,6.99 118.75,10.79 118.11,11.43 U4.5
  Top 1.016: D6.1 120.39,20.1 D6.3 118.11,12.51 U4.5
N$4
  Top 0.406: U2.6 87.26,10.16 R1.1
N$5
  Top 0.406: U2.7 87.26,8.89 R2.1
N$6
  Top 0.406: U1.6 59.32,10.16 R3.1
N$7
  Top 0.406: U1.7 59.32,8.89 R4.1
N$9
  Top 0.406: U3.6 31.38,10.16 R5.1
N$10
  Top 0.406: U3.7 31.38,8.89 R6.1
N$12
  Top 0.406: U4.6 115.2,10.16 R7.1
N$13
  Top 0.406: U4.7 115.2,8.89 R8.1
N$21
  Top 0.406: LED3.C R21.2
N$22
  Top 0.406: LED4.C R22.2
N$23
  Top 0.406: R15.1 SW1.2
N$24
  Top 0.406: SW1.1 R16.1
N$25
  Top 0.406: SW2.2 R17.1
N$27
  Top 0.406: R18.1 SW2.1
N$29
  Top 0.406: U$10.1 101.47,57.65 C19.2 C15.2 102.97,54.24 L2.1
N$30
  Top 0.406: L3.1 119.91,54.24 C21.2 C20.2 119.64,60.21 U$11.3
N$32  (via drill 0.4 pad 0.03)
  Top 0.127: U$5.14 70.83,58.71 73.66,55.88 73.66,51.44 v75.56,49.53
  Top 0.406: R13.1 109.22,52.44 TP15.P$1 109.22,59.69 U$10.4
  Bottom 0.127: v75.56,49.53 76.83,49.53 78.11,50.8 109.86,50.8 v111.12,52.07 111.12,58.42 U$10.4
N$33  (via drill 0.4 pad 0.03)
  Top 0.127: U$5.15 70.97,59.21 74.3,55.88 74.3,52.07 v75.56,50.8
  Top 0.406: TP16.P$1 U$11.1
  Route2 0.127: v75.56,50.8 111.76,50.8 112.78,52.07 112.78,58.42 U$11.1
N$34
  Top 0.406: LED1.C R19.2
N$35
  Top 0.406: R20.2 LED2.C
N$36
  Top 0.406: R23.1 59.97,25.14 D5.2
N$37
  Top 0.254: C4.2 63.77,6.08 62.87,6.99 62.87,10.79 62.23,11.43 U1.5
  Top 1.016: D5.1 64.51,20.1 D5.3 62.23,12.51 U1.5
N$38
  Top 0.406: R24.1 115.84,25.14 D6.2
N$42
  Top 0.406: R29.1 19.42,54.51 C29.2 19.42,53.45 R28.2
NRST  (via drill 0.4 pad 0.03)
  Top 0.127: C24.2 45.35,62.49 v45.09,62.23 | v66.04,53.34 65.66,53.73 U$5.7
  Top 0.406: C24.2 JP1.3
  Bottom 0.127: v45.09,62.23 45.09,56.52 45.72,55.88 45.72,53.98 46.99,52.7 65.41,52.7 v66.04,53.34
OSC_IN
  Top 0.127: C11.2 56.25,53.34 64.14,53.34 64.66,53.86 U$5.5 64.77,56.59
  Top 0.254: C11.2 54.98,45.45 54.61,45.09 Y1.1
OSC_OUT
  Top 0.127: C12.2 61.23,52.7 64.77,52.7 65.16,53.09 U$5.6
  Top 0.254: C12.2 60.59,45.45 60.96,45.09 Y1.2
PA6  (via drill 0.4 pad 0.03, 0.6)
  Top 0.127: U$5.16 71.1,59.71 73.66,57.15 v74.93,57.15 | v81.92,49.53 v81.92,52.07 | v29.21,49.53 v31.75,49.53
  Top 0.254: R32.1 v18.41,46.35 R33.2
  Route2 0.127: v18.41,46.35 18.41,47.62 19.05,48.26 28.57,48.26 29.21,48.9 v29.21,49.53 | v81.92,49.53 80.64,48.26 32.38,48.26 31.75,48.9 v31.75,49.53
  Bottom 0.127: v74.93,57.15 74.93,57.78 75.88,58.74 81.28,58.74 81.92,58.1 v81.92,52.07
PA11
  Top 0.127: U$5.32 64.66,66.79 62.87,68.58 38.1,68.58 36.2,66.67 36.2,64.66 LED2.A
PA12
  Top 0.127: U$5.33 64.16,66.66 62.87,67.94 38.1,67.94 37.47,67.31 37.47,65.52 LED1.A
PB0  (via drill 0.4 pad 0.03)
  Top 0.127: U$5.18 68.33,60.71 67.94,60.33 v67.94,59.69 | v71.75,55.88 72.39,55.24 72.39,50.16 v73.03,49.53 | v37.47,49.53 15.88,27.94 15.88,25.77 R31.2
  Top 0.406: R31.2 R30.1
  Route2 0.127: v73.03,49.53 v37.47,49.53
  Bottom 0.127: v67.94,59.69 67.94,55.88 68.58,55.24 71.12,55.24 v71.75,55.88
PB1  (via drill 0.4 pad 0.03)
  Top 0.127: U$5.19 66.29,61.21 66.04,60.96 66.04,60.33 v66.67,59.69 | v70.48,54.61 70.48,28.57 72.39,26.67 72.39,25.4 71.49,24.5 R26.2
  Top 0.406: 71.12,22.86 R25.1 R26.2
  Bottom 0.127: v66.67,59.69 66.67,57.78 67.31,57.15 67.31,55.24 67.94,54.61 v70.48,54.61
PB2  (via drill 0.4 pad 0.03)
  Top 0.127: U$12.7 v13.34,50.8 | U$5.20 66.16,61.71 65.41,60.96 v65.41,59.69 | v52.7,53.98 52.7,52.7 50.8,50.8 v27.94,50.8
  Route2 0.127: v65.41,59.69 65.41,59.05 64.14,57.78 v58.42,57.78
  Bottom 0.127: v58.42,57.78 57.15,57.78 v52.7,53.98 | v27.94,50.8 v13.34,50.8
PB5  (via drill 0.4 pad 0.03)
  Top 0.127: U$5.41 56.63,61.71 v56.52,61.59
  Route2 0.127: v56.52,61.59 71.75,61.59 74.3,59.05 78.74,59.05 JP3.6
PB6  (via drill 0.4 pad 0.03)
  Top 0.127: U$5.42 58.03,61.21 v57.78,60.96
  Route2 0.127: v57.78,60.96 69.85,60.96 72.39,58.42 75.56,58.42 76.2,57.78 76.2,57.15 76.83,56.52 78.74,56.52 JP3.8
PB7  (via drill 0.4 pad 0.03)
  Top 0.127: U$5.43 62.48,60.71 v62.87,60.33
  Route2 0.127: v62.87,60.33 69.22,60.33 75.56,53.98 78.74,53.98 JP3.10
PC13  (via drill 0.4 pad 0.03)
  Top 0.127: U$5.2 63.16,56.17 61.59,54.61 60.33,54.61 v59.69,53.98
  Route2 0.127: v59.69,53.98 59.69,52.7 60.33,52.07 77.34,52.07 JP3.9
PC14  (via drill 0.4 pad 0.03)
  Top 0.127: U$5.3 63.66,55.4 62.23,53.98 v60.96,53.98
  Route2 0.127: v60.96,53.98 60.96,53.34 61.59,52.7 v75.56,52.7
  Bottom 0.127: v75.56,52.7 75.56,52.83 JP3.7
PC15  (via drill 0.4 pad 0.03)
  Top 0.127: U$5.4 64.16,54.63 v63.5,53.98
  Bottom 0.127: v63.5,53.98 74.93,53.98 76.2,55.24 76.2,56.01 JP3.5
PE8  (via drill 0.4 pad 0.03)
  Top 0.127: U$5.21 71.78,62.21 72.39,61.59 74.93,61.59 v75.56,60.96
  Bottom 0.127: v75.56,60.96 76.07,60.96 JP3.1
PE9
  Top 0.127: U$5.22 71.91,62.71 72.39,62.23 75.56,62.23 JP3.3
PF6  (via drill 0.4 pad 0.03)
  Top 0.127: U$5.35 63.16,64.48 v64.14,63.5
  Route2 0.127: v64.14,63.5 64.77,62.87 76.2,62.87 77.47,64.14 78.11,64.14 79.38,62.87 80.01,62.87 JP3.2
PF7  (via drill 0.4 pad 0.03)
  Top 0.127: U$5.36 62.66,63.08 v62.87,62.87
  Route2 0.127: v62.87,62.87 63.5,62.23 76.2,62.23 76.83,61.59 78.74,61.59 JP3.4
PWR
  pour Top (no thermals): 0.64,38.1 1.27,37.47 12.7,37.47 13.34,38.1 13.34,44.45 12.7,45.09 10.16,45.09 9.53,45.72 9.53,50.8 8.89,51.44 1.27,51.44 0.64,50.8
PWR_SENSE  (via drill 0.4 pad 0.03, 0.4 pad 0.25)
  other vias: 106.68,34.29 106.68,33.02 105.41,33.02 105.41,34.29 104.14,34.29 104.14,33.02 50.8,34.29 50.8,33.02 49.53,33.02 49.53,34.29 48.26,34.29 48.26,33.02 19.68,41.91 18.41,40.64 18.41,41.91 17.14,41.91 17.14,40.64 15.88,40.64 15.88,41.91 19.68,40.64 46.99,34.29 46.99,33.02 45.72,33.02 45.72,34.29 44.45,34.29 44.45,33.02 102.87,34.29 102.87,33.02 101.6,33.02 101.6,34.29 100.33,34.29 100.33,33.02
  pour Top (no thermals): 15.24,45.09 14.61,44.45 14.61,40.64 15.24,40.01 19.68,40.01 20.32,40.64 20.32,42.55 19.68,43.18 17.78,43.18 17.14,43.81 17.14,44.45 16.51,45.09
  pour Top (no thermals): 50.8,34.92 50.8,23.5 50.16,22.86 47.62,22.86 47.62,15.24 52.07,15.24 52.07,34.92
  pour Top (no thermals): 106.68,34.92 106.68,23.5 106.05,22.86 103.5,22.86 103.5,15.24 107.95,15.24 107.95,34.92
  pour Top (no thermals): 104.78,5.08 107.31,5.08 107.95,5.71 107.95,15.24 103.5,15.24 104.14,14.61 104.14,5.71
  pour Top (no thermals): 48.9,5.08 51.44,5.08 52.07,5.71 52.07,15.24 47.62,15.24 48.26,14.61 48.26,5.71
  pour Top (no thermals): 103.5,22.86 103.5,34.92 106.68,34.92 106.68,22.86
  pour Top (no thermals): 47.62,22.86 47.62,34.92 51.44,34.92 51.44,22.86
  pour Top (no thermals): 52.07,13.34 52.7,13.34 54.61,15.24 54.61,20.95 52.7,22.86 43.18,22.86 42.55,22.23 42.55,19.68 43.18,19.05 46.99,19.05 47.62,18.41 47.62,15.24 50.16,15.24
  pour Top (no thermals): 107.95,13.34 108.58,13.34 110.49,15.24 110.49,20.95 108.58,22.86 99.06,22.86 98.42,22.23 98.42,19.68 99.06,19.05 102.87,19.05 103.5,18.41 103.5,15.24 106.05,15.24
  pour Bottom: 14.61,41.91 14.61,32.38 15.24,31.75 107.31,31.75 107.95,32.38 107.95,46.99 107.31,47.62 22.86,47.62 22.23,46.99 22.23,43.18 21.59,42.55 15.24,42.55
  pour Top (no thermals): 48.26,34.92 43.81,34.92 43.18,34.29 43.18,22.23 48.9,22.23 48.9,34.29
  pour Top (no thermals): 104.14,34.92 99.69,34.92 99.06,34.29 99.06,22.23 104.78,22.23 104.78,34.29
RS
  Top 0.406: R27.2 23.12,51.62 U6.8
RX  (via drill 0.4 pad 0.03)
  Top 0.127: v64.14,68.58 65.16,67.56 U$5.31 | v46.35,59.69 46.35,58.42
  Top 0.406: R21.1 46.35,58.42 JP1.7
  Route2 0.127: v46.35,59.69 46.35,67.94 46.99,68.58 v64.14,68.58
TCK
  Top 0.127: U$5.37 52.28,63.71 JP1.4
TDI  (via drill 0.4 pad 0.03)
  Top 0.127: U$5.38 54.95,63.21 v54.61,62.87
  Route2 0.127: v54.61,62.87 54.61,60.33 52.7,58.42 JP1.8
TDO
  Top 0.127: JP1.6 52.7,60.96 53.98,62.23 55.24,62.23 55.73,62.71 U$5.39
TMS
  Top 0.127: JP1.2 53.34,67.31 62.87,67.31 63.66,66.52 U$5.34
TRST
  Top 0.127: JP1.10 52.7,55.88 53.98,57.15 53.98,60.33 55.88,62.23 61.13,62.23 U$5.40
TX  (via drill 0.4 pad 0.03)
  Top 0.127: U$5.30 65.66,68.33 v65.41,68.58 | 46.99,60.96 v46.99,62.23
  Top 0.406: R22.1 46.99,60.96 JP1.5
  Bottom 0.127: v65.41,68.58 64.14,67.31 47.62,67.31 46.99,66.67 v46.99,62.23

### Text on the board
tPlace: Ben Petroski / EE391 - Winter/Spring 2016 / Multi-Level Converter